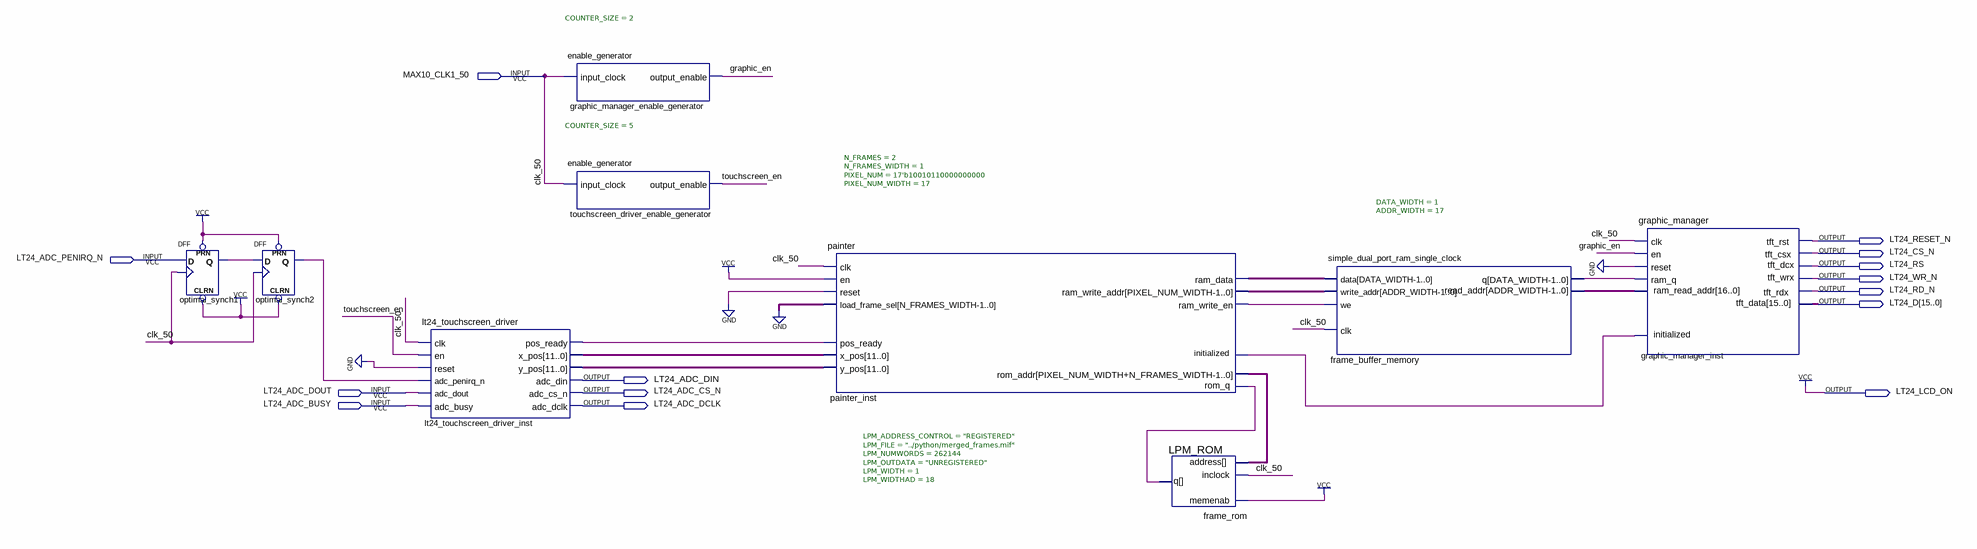
[diagram p0: schematic sheet]
// Quartus schematic graphic.bdf as structural Verilog: 9 symbols, 14 pins
module graphic (
  input  MAX10_CLK1_50,
  input  LT24_ADC_PENIRQ_N,
  input  LT24_ADC_DOUT,
  input  LT24_ADC_BUSY,
  output LT24_RESET_N,
  output LT24_CS_N,
  output LT24_RS,
  output LT24_WR_N,
  output LT24_RD_N,
  output [15:0] LT24_D,
  output LT24_ADC_DIN,
  output LT24_ADC_CS_N,
  output LT24_LCD_ON,
  output LT24_ADC_DCLK
);

  wire frame_buffer_memory_q, frame_rom_q, graphic_en, graphic_manager_inst_initialized,
       lt24_touchscreen_driver_inst_pos_ready, optimal_synch1_q, optimal_synch2_q, painter_inst_ram_data,
       painter_inst_ram_write_en, touchscreen_en;
  wire [11:0] lt24_touchscreen_driver_inst_x_pos, lt24_touchscreen_driver_inst_y_pos;
  wire [16:0] graphic_manager_inst_ram_read_addr, painter_inst_ram_write_addr;
  wire [17:0] painter_inst_rom_addr;

  DFF optimal_synch1 (.CLRN(1'b1), .CLK(MAX10_CLK1_50), .D(LT24_ADC_PENIRQ_N), .PRN(1'b1), .Q(optimal_synch1_q));
  DFF optimal_synch2 (.CLRN(1'b1), .CLK(MAX10_CLK1_50), .D(optimal_synch1_q), .PRN(1'b1), .Q(optimal_synch2_q));
  lt24_touchscreen_driver lt24_touchscreen_driver_inst (
    .clk(MAX10_CLK1_50), .en(touchscreen_en), .reset(1'b0), .adc_penirq_n(optimal_synch2_q),
    .adc_dout(LT24_ADC_DOUT), .adc_busy(LT24_ADC_BUSY), .pos_ready(lt24_touchscreen_driver_inst_pos_ready),
    .x_pos(lt24_touchscreen_driver_inst_x_pos), .y_pos(lt24_touchscreen_driver_inst_y_pos),
    .adc_din(LT24_ADC_DIN), .adc_cs_n(LT24_ADC_CS_N), .adc_dclk(LT24_ADC_DCLK));
  enable_generator #(.COUNTER_SIZE(2)) graphic_manager_enable_generator (
    .input_clock(MAX10_CLK1_50), .output_enable(graphic_en));
  enable_generator #(.COUNTER_SIZE(5)) touchscreen_driver_enable_generator (
    .input_clock(MAX10_CLK1_50), .output_enable(touchscreen_en));
  painter #(.N_FRAMES(2), .N_FRAMES_WIDTH(1), .PIXEL_NUM(17'b10010110000000000), .PIXEL_NUM_WIDTH(17)) painter_inst (
    .clk(MAX10_CLK1_50), .en(1'b1), .reset(1'b0), .load_frame_sel(1'b0), .rom_q(frame_rom_q),
    .initialized(graphic_manager_inst_initialized), .pos_ready(lt24_touchscreen_driver_inst_pos_ready),
    .x_pos(lt24_touchscreen_driver_inst_x_pos), .y_pos(lt24_touchscreen_driver_inst_y_pos),
    .rom_addr(painter_inst_rom_addr), .ram_data(painter_inst_ram_data),
    .ram_write_addr(painter_inst_ram_write_addr), .ram_write_en(painter_inst_ram_write_en));
  LPM_ROM #(.LPM_ADDRESS_CONTROL("REGISTERED"), .LPM_FILE("../python/merged_frames.mif"), .LPM_NUMWORDS(262144), .LPM_OUTDATA("UNREGISTERED"), .LPM_WIDTH(1), .LPM_WIDTHAD(18)) frame_rom (
    .address(painter_inst_rom_addr), .inclock(MAX10_CLK1_50), .memenab(1'b1), .q(frame_rom_q));
  simple_dual_port_ram_single_clock #(.DATA_WIDTH(1), .ADDR_WIDTH(17)) frame_buffer_memory (
    .data(painter_inst_ram_data), .read_addr(graphic_manager_inst_ram_read_addr),
    .write_addr(painter_inst_ram_write_addr), .we(painter_inst_ram_write_en), .clk(MAX10_CLK1_50),
    .q(frame_buffer_memory_q));
  graphic_manager graphic_manager_inst (
    .clk(MAX10_CLK1_50), .en(graphic_en), .reset(1'b0), .ram_q(frame_buffer_memory_q),
    .tft_rst(LT24_RESET_N), .tft_csx(LT24_CS_N), .tft_dcx(LT24_RS),
    .ram_read_addr(graphic_manager_inst_ram_read_addr), .tft_wrx(LT24_WR_N),
    .initialized(graphic_manager_inst_initialized), .tft_rdx(LT24_RD_N), .tft_data(LT24_D));

  assign LT24_LCD_ON = 1'b1;

  // Other names for the same wires on the sheet: clk_50 = MAX10_CLK1_50
endmodule
